# EAGLE design lilla (EAGLE 7.7.0)
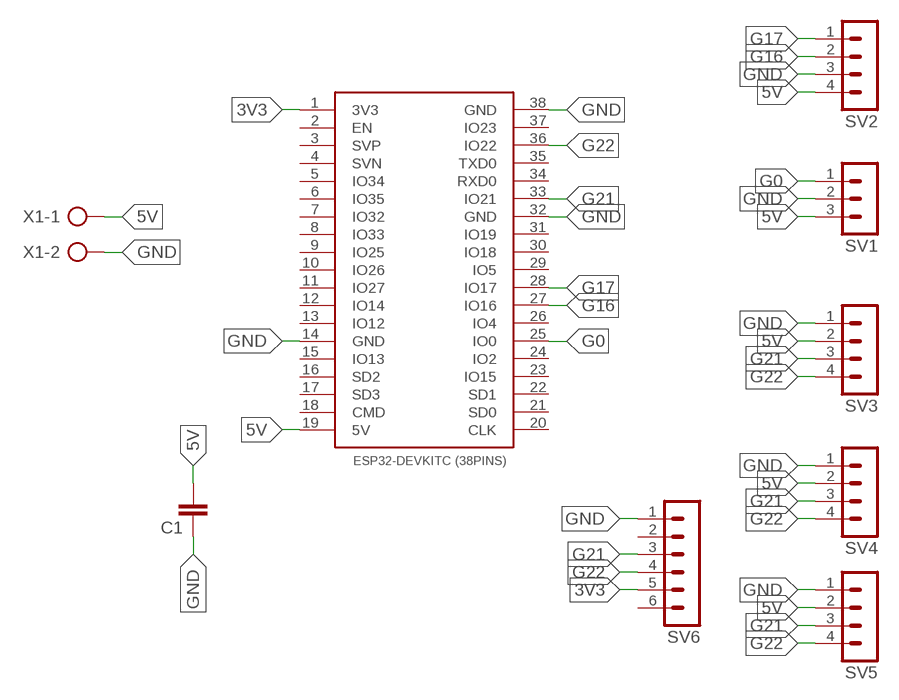
[diagram p0: schematic, sheet 1]

## Parts
C1  C-EU050-024X044  [C050-024X044]
ESP32-DEVKITC(38PINS)2  ESP32DEVKITC_38PINS  [ESP32-DEVKITC]
SV1  MA03-1  [MA03-1]
SV2  MA04-1  [MA04-1]
SV3  MA04-1  [MA04-1]
SV4  MA04-1  [MA04-1]
SV5  MA04-1  [MA04-1]
SV6  MA06-1  [MA06-1]
X1  AK300/2  [AK300/2]

## Nets
3V3: ESP32-DEVKITC(38PINS)2.1(3V3) SV6.5
5V: C1.2 ESP32-DEVKITC(38PINS)2.19(5V) SV1.3 SV2.4 SV3.2 SV4.2 SV5.2 X1.1
G0: ESP32-DEVKITC(38PINS)2.25(IO0) SV1.1
G16: ESP32-DEVKITC(38PINS)2.27(IO16) SV2.2
G17: ESP32-DEVKITC(38PINS)2.28(IO17) SV2.1
G21: ESP32-DEVKITC(38PINS)2.33(IO21) SV3.3 SV4.3 SV5.3 SV6.3
G22: ESP32-DEVKITC(38PINS)2.36(IO22) SV3.4 SV4.4 SV5.4 SV6.4
GND: C1.1 ESP32-DEVKITC(38PINS)2.14(GND) ESP32-DEVKITC(38PINS)2.32(GND) ESP32-DEVKITC(38PINS)2.38(GND) SV1.2 SV2.3 SV3.1 SV4.1 SV5.1 SV6.1 X1.2
Unconnected: ESP32-DEVKITC(38PINS)2.2(EN) ESP32-DEVKITC(38PINS)2.3(SVP) ESP32-DEVKITC(38PINS)2.4(SVN) ESP32-DEVKITC(38PINS)2.5(IO34) ESP32-DEVKITC(38PINS)2.6(IO35) ESP32-DEVKITC(38PINS)2.7(IO32) ESP32-DEVKITC(38PINS)2.8(IO33) ESP32-DEVKITC(38PINS)2.9(IO25) ESP32-DEVKITC(38PINS)2.10(IO26) ESP32-DEVKITC(38PINS)2.11(IO27) ESP32-DEVKITC(38PINS)2.12(IO14) ESP32-DEVKITC(38PINS)2.13(IO12) ESP32-DEVKITC(38PINS)2.15(IO13) ESP32-DEVKITC(38PINS)2.16(SD2) ESP32-DEVKITC(38PINS)2.17(SD3) ESP32-DEVKITC(38PINS)2.18(CMD) ESP32-DEVKITC(38PINS)2.20(CLK) ESP32-DEVKITC(38PINS)2.21(SD0) ESP32-DEVKITC(38PINS)2.22(SD1) ESP32-DEVKITC(38PINS)2.23(IO15) ESP32-DEVKITC(38PINS)2.24(IO2) ESP32-DEVKITC(38PINS)2.26(IO4) ESP32-DEVKITC(38PINS)2.29(IO5) ESP32-DEVKITC(38PINS)2.30(IO18) ESP32-DEVKITC(38PINS)2.31(IO19) ESP32-DEVKITC(38PINS)2.34(RXD0) ESP32-DEVKITC(38PINS)2.35(TXD0) ESP32-DEVKITC(38PINS)2.37(IO23) SV6.2 SV6.6

## Library data of the parts
C1 = rcl:C-EU: CAPACITOR, European symbol
ESP32-DEVKITC(38PINS)2 = ESP32-DEVKITC(38PINS):ESP32DEVKITC
SV1 = con-lstb:MA03-1: PIN HEADER; OC_FARNELL: unknown; OC_NEWARK: unknown
SV2-SV5 = con-lstb:MA04-1: PIN HEADER; OC_FARNELL: unknown; OC_NEWARK: unknown
SV6 = con-lstb:MA06-1: PIN HEADER; OC_FARNELL: unknown; OC_NEWARK: unknown
X1 = con-ptr500:AK300/2: CONNECTOR; OC_FARNELL: unknown; OC_NEWARK: unknown

## Board
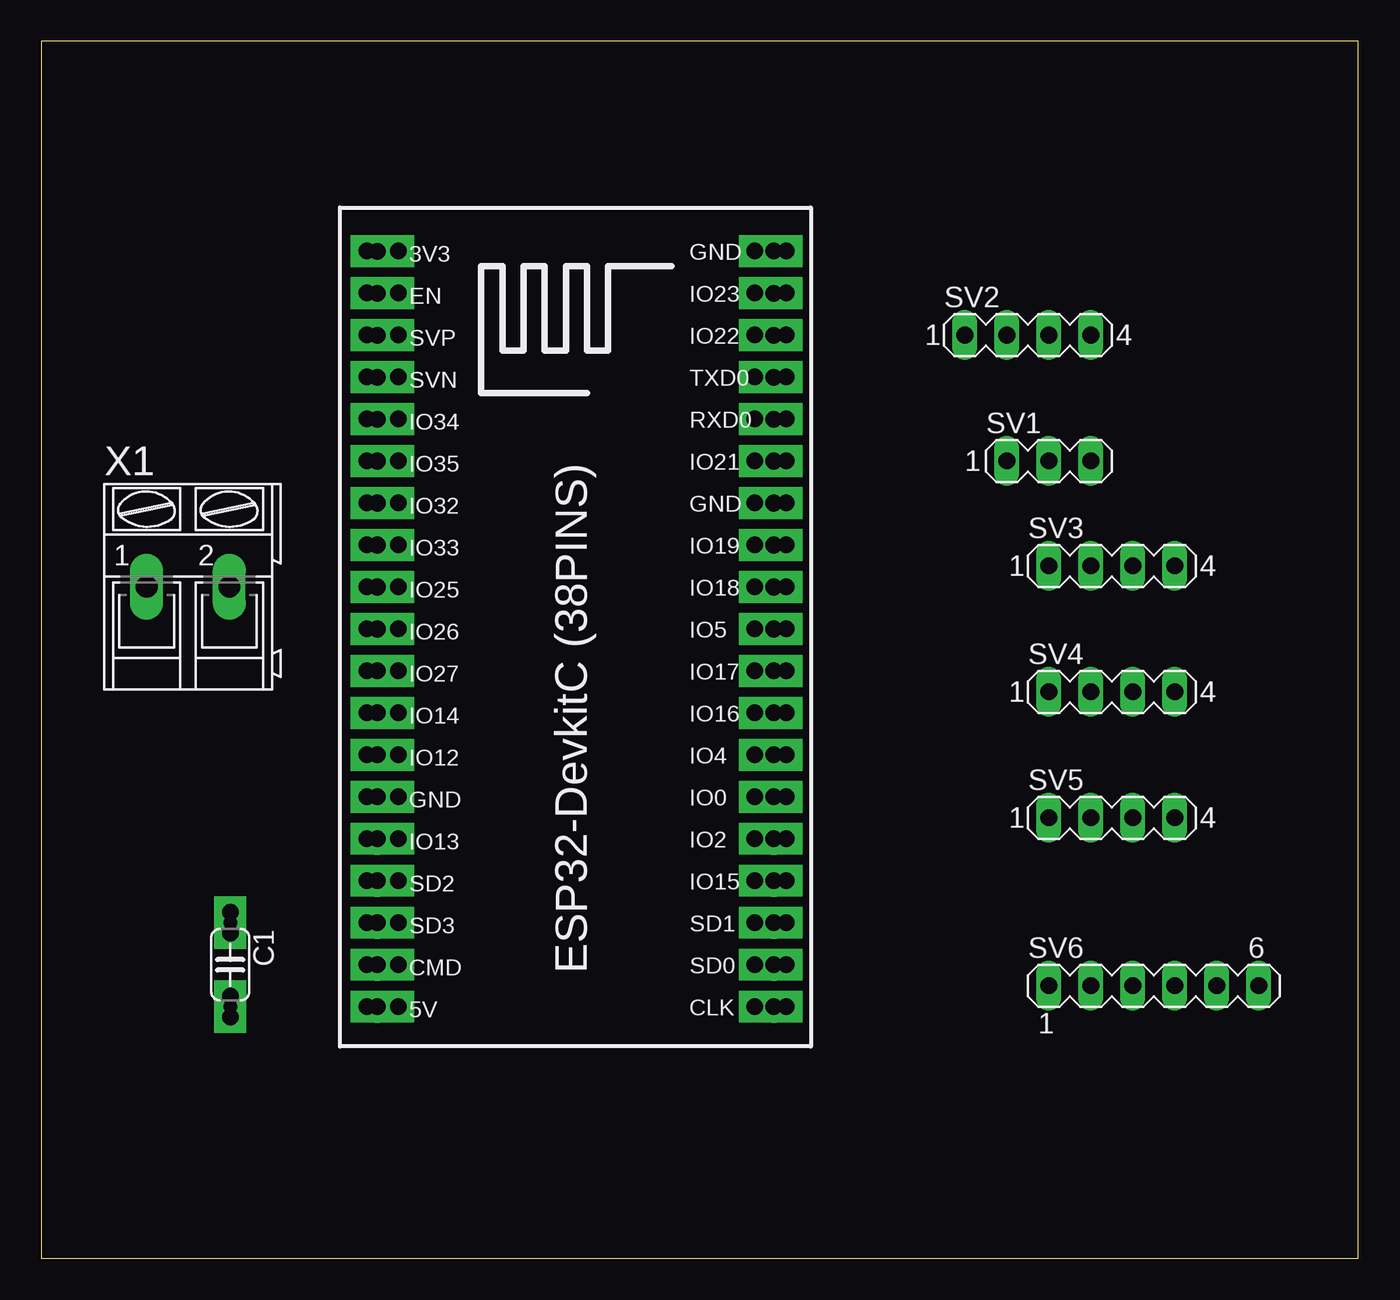
[diagram p1: board, top side]
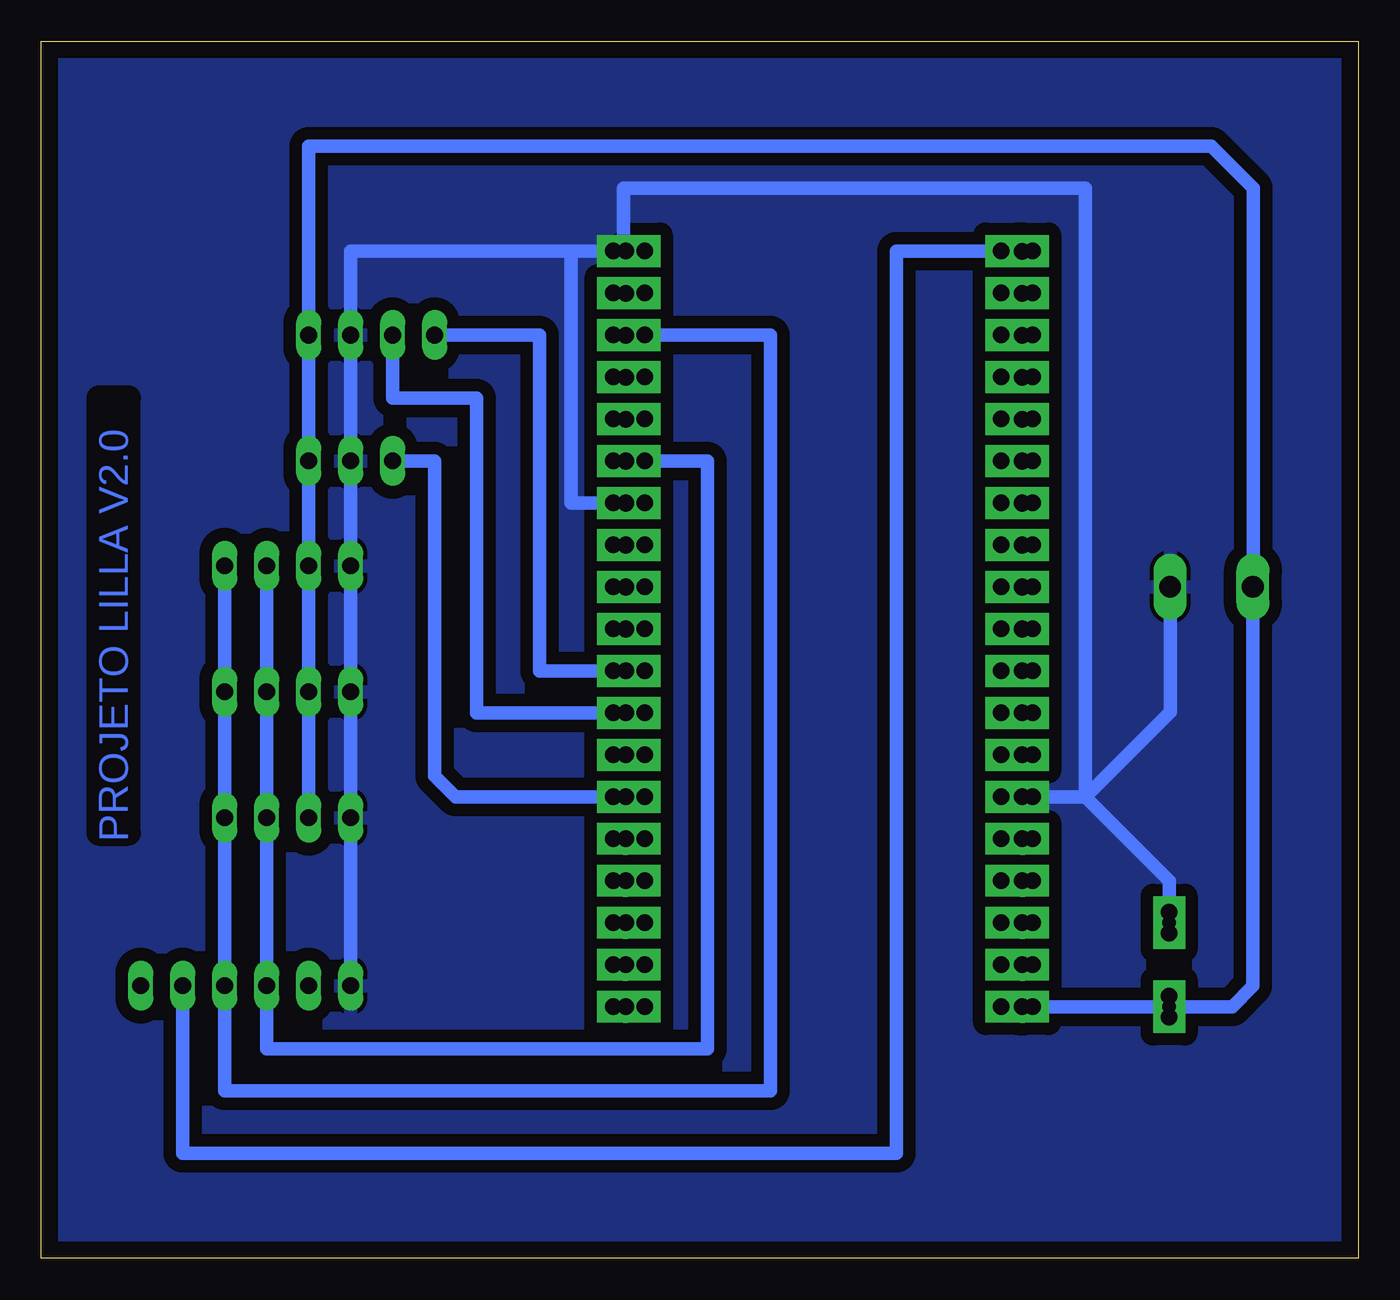
[diagram p2: board, bottom side, seen from below]

Size 79.68 x 73.65 mm. Coordinates in mm from the lower left corner, seen from the top.
Outline: 0,0 79.68,0 79.68,73.65 0,73.65 0,0
Copper layers (1*16): Top 0.035mm / dielectric 1.5mm / Bottom 0.035mm
Design rules "default *": minimum track width 32mil, minimum drill 24mil, track to track 30mil, track to pad 30mil, pad to pad 30mil, via to via 30mil, smd to smd 30mil, copper to edge 40mil, drill to drill 8mil, minimum pad ring 10mil, minimum via ring 8mil, stop-mask expansion 4mil, vias tented up to drill 0mil, thermal gap 10mil

### Footprints (pad centres in the part's own frame; a part is rotated, then mirrored left to right if it is on the bottom)
C050-024X044 = drill 0.813 octagon: 1 -2.54,0; 2 2.54,0
ESP32-DEVKITC = drill 1 pad 1.93: 1 0.01,0; 2 2.55,0; 3 5.09,0; 4 7.63,0; 5 10.17,0; 6 12.71,0; 7 15.25,0; 8 17.79,0; 9 20.33,0; 10 22.87,0; 11 25.41,0; 12 27.95,0; 13 30.49,0; 14 33.03,0; 15 35.57,0; 16 38.11,0; 17 40.65,0; 18 43.19,0; 19 45.73,0; 20 45.73,24; 21 43.19,24; 22 40.65,24; 23 38.11,24; 24 35.57,24; 25 33.03,24; 26 30.49,24; 27 27.95,24; 28 25.41,24; 29 22.87,24; 30 20.33,24; 31 17.79,24; 32 15.25,24; 33 12.71,24; 34 10.17,24; 35 7.63,24; 36 5.09,24; 37 2.55,24; 38 0,24
MA03-1 = drill 1.016 long: 1 -2.54,0; 2 0,0; 3 2.54,0
MA04-1 = drill 1.016 long: 1 -3.81,0; 2 -1.27,0; 3 1.27,0; 4 3.81,0
MA06-1 = drill 1.016 long: 1 -6.35,0; 2 -3.81,0; 3 -1.27,0; 4 1.27,0; 5 3.81,0; 6 6.35,0
AK300/2 = drill 1.321 long: 1 -2.515,0; 2 2.489,0

### Placement (x,y rotation side)
C1  11.43,17.78 270 top
ESP32-DEVKITC(38PINS)2  20.32,60.96 270 top
SV1  60.96,48.26 0 top
SV2  59.69,55.88 0 top
SV3  64.77,41.91 0 top
SV4  64.77,34.29 0 top
SV5  64.77,26.67 0 top
SV6  67.31,16.51 0 top
X1  8.89,40.64 0 top

### Tracks (layer width: path | path; a pad name or v marks a point on that pad's centre or on a via)
3V3
  Bottom 0.813: ESP32-DEVKITC(38PINS)2.1 27.93,60.95 27.94,60.96 27.94,6.35 71.12,6.35 SV6.5
5V
  Bottom 0.813: SV5.2 SV4.2 SV3.2 SV1.3 SV2.4 63.5,67.31 8.89,67.31 6.35,64.77 6.35,40.64 X1.1 6.38,16.48 7.62,15.24 C1.2 ESP32-DEVKITC(38PINS)2.19
G0  (via drill 1 pad 1.93)
  Bottom 0.813: ESP32-DEVKITC(38PINS)2.25 v45.09,27.94 54.61,27.94 55.88,29.21 55.88,48.26 SV1.1
G16  (via drill 1 pad 1.93)
  Bottom 0.813: ESP32-DEVKITC(38PINS)2.27 v45.09,33.02 53.34,33.02 53.34,52.07 58.42,52.07 SV2.2
G17  (via drill 1 pad 1.93)
  Bottom 0.813: ESP32-DEVKITC(38PINS)2.28 v45.09,35.56 49.53,35.56 49.53,55.88 SV2.1
G21
  Bottom 0.813: ESP32-DEVKITC(38PINS)2.33 39.38,48.25 39.37,48.26 39.37,12.7 66.04,12.7 SV6.3 SV5.3 SV4.3 SV3.3
G22
  Bottom 0.813: SV3.4 SV4.4 SV5.4 SV6.4 68.58,10.16 35.56,10.16 35.56,55.88 35.57,55.87 ESP32-DEVKITC(38PINS)2.36
GND  (via drill 1 pad 1.93)
  Bottom 0.813: C1.1 11.43,22.86 16.51,27.94 | 16.51,27.94 v19.68,27.94 ESP32-DEVKITC(38PINS)2.14 16.52,27.93 16.51,27.94 | X1.2 11.38,33.07 16.51,27.94 | 47.62,60.96 60.96,60.96 SV2.3 SV1.2 SV3.1 SV4.1 SV5.1 SV6.1 | 44.45,60.96 v45.09,60.96 47.62,60.96 | 47.62,60.96 47.62,45.71 ESP32-DEVKITC(38PINS)2.32 | 16.51,27.94 16.51,64.77 44.45,64.77 44.45,61.09 ESP32-DEVKITC(38PINS)2.38
  pour Bottom: 0,73.66 80.01,73.66 80.01,0 0,0
N$1  (via drill 1 pad 1.93)
  other vias: 11.43,20.95
N$2  (via drill 1 pad 1.93)
  other vias: 11.43,14.6
N$3  (via drill 1 pad 1.93)
  other vias: 11.43,15.88
N$4  (via drill 1 pad 1.93)
  other vias: 11.43,19.69
N$5  (via drill 1 pad 1.93)
  other vias: 19.68,60.96
N$6  (via drill 1 pad 1.93)
  other vias: 21.59,60.96
N$7  (via drill 1 pad 1.93)
  other vias: 21.59,58.42
N$8  (via drill 1 pad 1.93)
  other vias: 19.68,58.42
N$9  (via drill 1 pad 1.93)
  other vias: 19.68,55.88
N$10  (via drill 1 pad 1.93)
  other vias: 19.68,53.34
N$11  (via drill 1 pad 1.93)
  other vias: 19.68,50.8
N$12  (via drill 1 pad 1.93)
  other vias: 19.68,48.26
N$13  (via drill 1 pad 1.93)
  other vias: 19.68,45.72
N$14  (via drill 1 pad 1.93)
  other vias: 19.68,43.18
N$15  (via drill 1 pad 1.93)
  other vias: 19.68,40.64
N$16  (via drill 1 pad 1.93)
  other vias: 19.68,38.1
N$17  (via drill 1 pad 1.93)
  other vias: 19.68,35.56
N$18  (via drill 1 pad 1.93)
  other vias: 19.68,33.02
N$19  (via drill 1 pad 1.93)
  other vias: 19.68,30.48
N$20  (via drill 1 pad 1.93)
  other vias: 19.68,25.4
N$21  (via drill 1 pad 1.93)
  other vias: 19.68,22.86
N$22  (via drill 1 pad 1.93)
  other vias: 19.68,20.32
N$23  (via drill 1 pad 1.93)
  other vias: 19.68,17.78
N$24  (via drill 1 pad 1.93)
  other vias: 19.68,15.24
N$25  (via drill 1 pad 1.93)
  other vias: 21.59,55.88
N$26  (via drill 1 pad 1.93)
  other vias: 21.59,53.34
N$27  (via drill 1 pad 1.93)
  other vias: 21.59,50.8
N$28  (via drill 1 pad 1.93)
  other vias: 21.59,48.26
N$29  (via drill 1 pad 1.93)
  other vias: 21.59,45.72
N$30  (via drill 1 pad 1.93)
  other vias: 21.59,43.18
N$31  (via drill 1 pad 1.93)
  other vias: 21.59,40.64
N$32  (via drill 1 pad 1.93)
  other vias: 21.59,38.1
N$33  (via drill 1 pad 1.93)
  other vias: 21.59,35.56
N$34  (via drill 1 pad 1.93)
  other vias: 21.59,33.02
N$35  (via drill 1 pad 1.93)
  other vias: 21.59,30.48
N$36  (via drill 1 pad 1.93)
  other vias: 21.59,27.94
N$37  (via drill 1 pad 1.93)
  other vias: 21.59,25.4
N$38  (via drill 1 pad 1.93)
  other vias: 21.59,22.86
N$39  (via drill 1 pad 1.93)
  other vias: 21.59,20.32
N$40  (via drill 1 pad 1.93)
  other vias: 21.59,17.78
N$41  (via drill 1 pad 1.93)
  other vias: 21.59,15.24
N$42  (via drill 1 pad 1.93)
  other vias: 43.18,15.24
N$43  (via drill 1 pad 1.93)
  other vias: 43.18,17.78
N$44  (via drill 1 pad 1.93)
  other vias: 43.18,20.32
N$45  (via drill 1 pad 1.93)
  other vias: 43.18,22.86
N$46  (via drill 1 pad 1.93)
  other vias: 43.18,25.4
N$47  (via drill 1 pad 1.93)
  other vias: 43.18,27.94
N$48  (via drill 1 pad 1.93)
  other vias: 43.18,30.48
N$49  (via drill 1 pad 1.93)
  other vias: 43.18,33.02
N$50  (via drill 1 pad 1.93)
  other vias: 43.18,35.56
N$51  (via drill 1 pad 1.93)
  other vias: 43.18,38.1
N$52  (via drill 1 pad 1.93)
  other vias: 43.18,40.64
N$53  (via drill 1 pad 1.93)
  other vias: 43.18,43.18
N$54  (via drill 1 pad 1.93)
  other vias: 43.18,45.72
N$55  (via drill 1 pad 1.93)
  other vias: 43.18,48.26
N$56  (via drill 1 pad 1.93)
  other vias: 43.18,50.8
N$57  (via drill 1 pad 1.93)
  other vias: 43.18,53.34
N$58  (via drill 1 pad 1.93)
  other vias: 43.18,55.88
N$59  (via drill 1 pad 1.93)
  other vias: 43.18,58.42
N$60  (via drill 1 pad 1.93)
  other vias: 43.18,60.96
N$61  (via drill 1 pad 1.93)
  other vias: 45.09,58.42
N$62  (via drill 1 pad 1.93)
  other vias: 45.09,55.88
N$63  (via drill 1 pad 1.93)
  other vias: 45.09,53.34
N$64  (via drill 1 pad 1.93)
  other vias: 45.09,50.8
N$65  (via drill 1 pad 1.93)
  other vias: 45.09,48.26
N$66  (via drill 1 pad 1.93)
  other vias: 45.09,45.72
N$67  (via drill 1 pad 1.93)
  other vias: 45.09,43.18
N$68  (via drill 1 pad 1.93)
  other vias: 45.09,40.64
N$69  (via drill 1 pad 1.93)
  other vias: 45.09,38.1
N$70  (via drill 1 pad 1.93)
  other vias: 45.09,30.48
N$71  (via drill 1 pad 1.93)
  other vias: 45.09,25.4
N$72  (via drill 1 pad 1.93)
  other vias: 45.09,22.86
N$73  (via drill 1 pad 1.93)
  other vias: 45.09,20.32
N$74  (via drill 1 pad 1.93)
  other vias: 45.09,17.78
N$75  (via drill 1 pad 1.93)
  other vias: 45.09,15.24

### Text on the board
Bottom: PROJETO LILLA V2.0🐧